# Altium schematic sheet TLM_002_MBR.SchDoc: =DocumentName
size A4; CompanyName: "Scopa Industries" LLC; Engineer: Nazar Lysenko / Andrii Antonenko; Organization: "Scopa Industries" LLC; Address1: Kyiv; Address2: Ukraine; Address3: https://www.scopa.industries/; Address4: oleksyi.y@scopa.industries; SheetNumber: 1; SheetTotal: 11
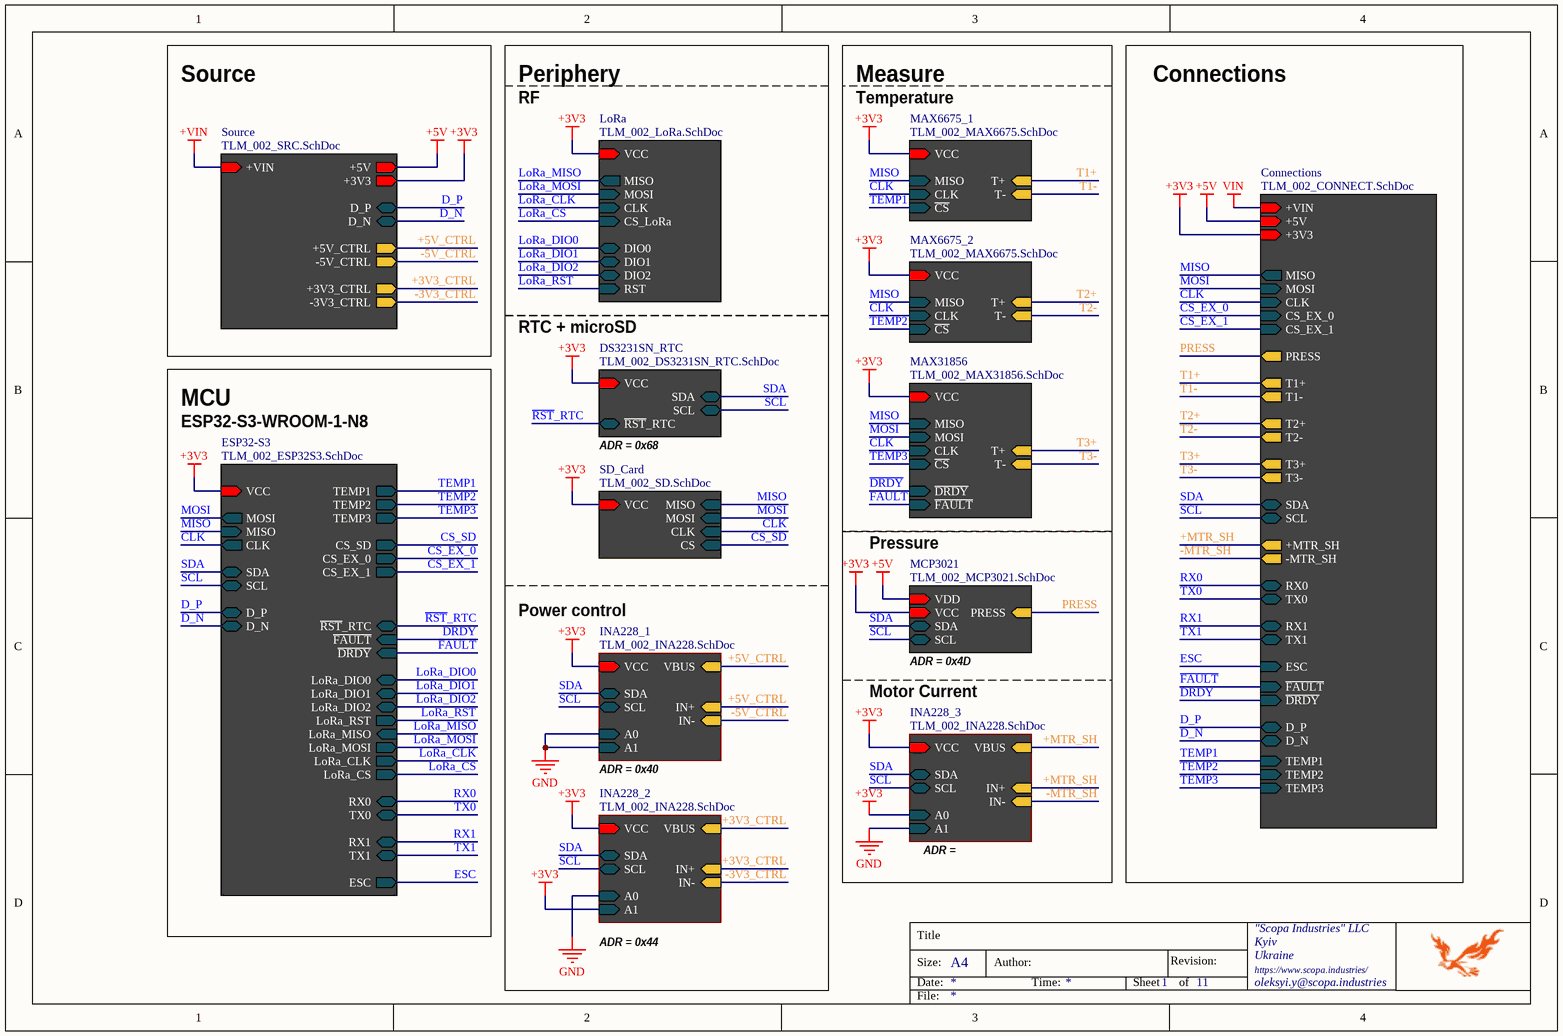
[diagram p0: TLM_002_MBR.SchDoc]

## Sub-sheets
Connections = TLM_002_CONNECT.SchDoc: +VIN (in), +5V (in), +3V3 (in), MISO (out), MOSI (in), CLK (in), CS_EX_0 (in), CS_EX_1 (in), PRESS (out), T1+ (out), T1- (out), T2+ (out), T2- (out), T3+ (out), T3- (out), SDA (bidir), SCL (bidir), +MTR_SH (out), -MTR_SH (out), RX0 (bidir), TX0 (bidir), RX1 (bidir), TX1 (bidir), ESC (in), ~{DRDY} (in), ~{FAULT} (in), D_N (bidir), D_P (bidir), TEMP1 (in), TEMP2 (in), TEMP3 (in)
DS3231SN_RTC = TLM_002_DS3231SN_RTC.SchDoc: VCC (in), SCL (bidir), SDA (bidir), ~{RST}_RTC (bidir)
ESP32-S3 = TLM_002_ESP32S3.SchDoc: MOSI (out), CLK (out), SCL (bidir), SDA (bidir), TEMP3 (out), TEMP2 (out), TEMP1 (out), VCC (in), ~{RST}_RTC (bidir), CS_SD (out), D_N (bidir), TX0 (bidir), RX0 (bidir), D_P (bidir), MISO (in), ~{DRDY} (in), ~{FAULT} (in), LoRa_RST (out), LoRa_DIO0 (bidir), LoRa_DIO1 (bidir), LoRa_DIO2 (bidir), LoRa_MOSI (out), LoRa_CLK (out), LoRa_CS (out), LoRa_MISO (in), TX1 (bidir), RX1 (bidir), ESC (out), CS_EX_1 (out), CS_EX_0 (out)
INA228_1 = TLM_002_INA228.SchDoc: SCL (bidir), SDA (bidir), A1 (in), A0 (in), IN- (in), IN+ (in), VCC (in), VBUS (in)
INA228_2 = TLM_002_INA228.SchDoc: SCL (bidir), SDA (bidir), A1 (in), A0 (in), IN- (in), IN+ (in), VCC (in), VBUS (in)
INA228_3 = TLM_002_INA228.SchDoc: SCL (bidir), SDA (bidir), A1 (in), A0 (in), IN- (in), IN+ (in), VCC (in), VBUS (in)
LoRa = TLM_002_LoRa.SchDoc: VCC (in), MOSI (in), CLK (in), MISO (out), CS_LoRa (in), RST (in), DIO0 (bidir), DIO1 (bidir), DIO2 (bidir)
MAX6675_1 = TLM_002_MAX6675.SchDoc: CLK (in), MISO (in), ~{CS} (in), T+ (in), T- (in), VCC (in)
MAX6675_2 = TLM_002_MAX6675.SchDoc: CLK (in), MISO (in), ~{CS} (in), T+ (in), T- (in), VCC (in)
MAX31856 = TLM_002_MAX31856.SchDoc: VCC (in), CLK (in), MISO (in), ~{CS} (in), MOSI (in), ~{DRDY} (in), ~{FAULT} (in), T+ (in), T- (in)
MCP3021 = TLM_002_MCP3021.SchDoc: SCL (bidir), SDA (bidir), VDD (in), PRESS (in), VCC (in)
SD_Card = TLM_002_SD.SchDoc: VCC (in), CLK (in), CS (in), MISO (in), MOSI (in)
Source = TLM_002_SRC.SchDoc: +VIN (in), D_P (bidir), D_N (bidir), +3V3 (out), +5V (out), -5V_CTRL (out), +5V_CTRL (out), -3V3_CTRL (out), +3V3_CTRL (out)

## Nets
+3V3: sheet MAX6675_1/VCC, sheet MCP3021/VCC, sheet INA228_3/A0, sheet INA228_3/VCC, sheet ESP32-S3/VCC, sheet MAX31856/VCC, sheet SD_Card/VCC, sheet DS3231SN_RTC/VCC, sheet MAX6675_2/VCC, sheet INA228_2/A1, sheet INA228_2/VCC, sheet INA228_1/VCC, sheet Source/+3V3, sheet LoRa/VCC, sheet Connections/+3V3
+5V: sheet MCP3021/VDD, sheet Source/+5V, sheet Connections/+5V
+VIN: sheet Source/+VIN
GND: sheet INA228_3/A1, sheet INA228_2/A0, sheet INA228_1/A1, sheet INA228_1/A0
VIN: sheet Connections/+VIN
+3V3_CTRL: sheet INA228_2/IN+, sheet INA228_2/VBUS, sheet Source/+3V3_CTRL
+5V_CTRL: sheet INA228_1/IN+, sheet INA228_1/VBUS, sheet Source/+5V_CTRL
+MTR_SH: sheet INA228_3/IN+, sheet INA228_3/VBUS, sheet Connections/+MTR_SH
-3V3_CTRL: sheet INA228_2/IN-, sheet Source/-3V3_CTRL
-5V_CTRL: sheet INA228_1/IN-, sheet Source/-5V_CTRL
-MTR_SH: sheet INA228_3/IN-, sheet Connections/-MTR_SH
CLK: sheet MAX6675_1/CLK, sheet ESP32-S3/CLK, sheet MAX31856/CLK, sheet SD_Card/CLK, sheet MAX6675_2/CLK, sheet Connections/CLK
CS_EX_0: sheet ESP32-S3/CS_EX_0, sheet Connections/CS_EX_0
CS_EX_1: sheet ESP32-S3/CS_EX_1, sheet Connections/CS_EX_1
CS_SD: sheet ESP32-S3/CS_SD, sheet SD_Card/CS
~{DRDY}: sheet ESP32-S3/~{FAULT}, sheet MAX31856/~{DRDY}, sheet Connections/~{DRDY}
D_N: sheet ESP32-S3/D_N, sheet Source/D_N, sheet Connections/D_N
D_P: sheet ESP32-S3/D_P, sheet Source/D_P, sheet Connections/D_P
ESC: sheet ESP32-S3/ESC, sheet Connections/ESC
~{FAULT}: sheet ESP32-S3/~{DRDY}, sheet MAX31856/~{FAULT}, sheet Connections/~{FAULT}
LoRa_CLK: sheet ESP32-S3/LoRa_CLK, sheet LoRa/CLK
LoRa_CS: sheet ESP32-S3/LoRa_CS, sheet LoRa/CS_LoRa
LoRa_DIO0: sheet ESP32-S3/LoRa_DIO0, sheet LoRa/DIO0
LoRa_DIO1: sheet ESP32-S3/LoRa_DIO1, sheet LoRa/DIO1
LoRa_DIO2: sheet ESP32-S3/LoRa_DIO2, sheet LoRa/DIO2
LoRa_MISO: sheet ESP32-S3/LoRa_MISO, sheet LoRa/MISO
LoRa_MOSI: sheet ESP32-S3/LoRa_MOSI, sheet LoRa/MOSI
LoRa_RST: sheet ESP32-S3/LoRa_RST, sheet LoRa/RST
MISO: sheet MAX6675_1/MISO, sheet ESP32-S3/MISO, sheet MAX31856/MISO, sheet SD_Card/MISO, sheet MAX6675_2/MISO, sheet Connections/MISO
MOSI: sheet ESP32-S3/MOSI, sheet MAX31856/MOSI, sheet SD_Card/MOSI, sheet Connections/MOSI
PRESS: sheet MCP3021/PRESS, sheet Connections/PRESS
~{RST}_RTC: sheet ESP32-S3/~{RST}_RTC, sheet DS3231SN_RTC/~{RST}_RTC
RX0: sheet ESP32-S3/RX0, sheet Connections/RX0
RX1: sheet ESP32-S3/RX1, sheet Connections/RX1
SCL: sheet MCP3021/SCL, sheet INA228_3/SCL, sheet ESP32-S3/SCL, sheet DS3231SN_RTC/SCL, sheet INA228_2/SCL, sheet INA228_1/SCL, sheet Connections/SCL
SDA: sheet MCP3021/SDA, sheet INA228_3/SDA, sheet ESP32-S3/SDA, sheet DS3231SN_RTC/SDA, sheet INA228_2/SDA, sheet INA228_1/SDA, sheet Connections/SDA
T1+: sheet MAX6675_1/T+, sheet Connections/T1+
T1-: sheet MAX6675_1/T-, sheet Connections/T1-
T2+: sheet MAX6675_2/T+, sheet Connections/T2+
T2-: sheet MAX6675_2/T-, sheet Connections/T2-
T3+: sheet MAX31856/T+, sheet Connections/T3+
T3-: sheet MAX31856/T-, sheet Connections/T3-
TEMP1: sheet MAX6675_1/~{CS}, sheet ESP32-S3/TEMP1, sheet Connections/TEMP1
TEMP2: sheet ESP32-S3/TEMP2, sheet MAX6675_2/~{CS}, sheet Connections/TEMP2
TEMP3: sheet ESP32-S3/TEMP3, sheet MAX31856/~{CS}, sheet Connections/TEMP3
TX0: sheet ESP32-S3/TX0, sheet Connections/TX0
TX1: sheet ESP32-S3/TX1, sheet Connections/TX1

## Notes on the sheet
- Source
- Periphery
- RF
- Measure
- Temperature
- Connections
- RTC + microSD
- MCU
- ESP32-S3-WROOM-1-N8
- ADR = 0x68
- Pressure
- Power control
- Motor Current
- ADR = 0x4D
- ADR = 0x40
- ADR = 0x41
- ADR = 0x44
- Title
- Size:
- Date:
- A4
- Author:
- Time:
- Sheet
- Revision:
- of
- File: